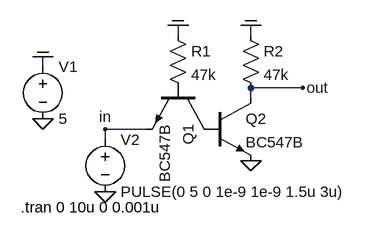
[diagram p0: schematic ttl1.asc]
ttl1.asc, the LTspice schematic file:
Version 4
SHEET 1 880 680
WIRE 288 96 288 80
WIRE 400 96 400 80
WIRE 80 144 80 128
WIRE 480 176 400 176
WIRE 400 192 400 176
WIRE 240 240 176 240
WIRE 176 256 176 240
FLAG 80 224 0
FLAG 80 128 COM
FLAG 400 288 0
FLAG 176 336 0
FLAG 288 80 COM
FLAG 400 80 COM
FLAG 176 240 in
FLAG 480 176 out
SYMBOL voltage 80 128 R0
WINDOW 123 0 0 Left 2
WINDOW 39 0 0 Left 2
SYMATTR InstName V1
SYMATTR Value 5
SYMBOL res 272 80 R0
SYMATTR InstName R1
SYMATTR Value 47k
SYMBOL npn 336 176 R90
SYMATTR InstName Q1
SYMATTR Value BC547B
SYMBOL npn 336 192 R0
SYMATTR InstName Q2
SYMATTR Value BC547B
SYMBOL res 384 80 R0
SYMATTR InstName R2
SYMATTR Value 47k
SYMBOL voltage 176 240 R0
WINDOW 123 0 0 Left 2
WINDOW 39 0 0 Left 2
SYMATTR InstName V2
SYMATTR Value PULSE(0 5 0 1e-9 1e-9 1.5u 3u)
TEXT 46 360 Left 2 !.tran 0 10u 0 0.001u

The netlist it stands for:
* ttl1.asc
V1 COM 0 5
R1 COM P001 47k
Q1 P002 P001 in 0 BC547B
Q2 out P002 0 0 BC547B
R2 COM out 47k
V2 in 0 PULSE(0 5 0 1e-9 1e-9 1.5u 3u)
.model NPN NPN
.model PNP PNP
.lib standard.bjt
.tran 0 10u 0 0.001u
.backanno
.end